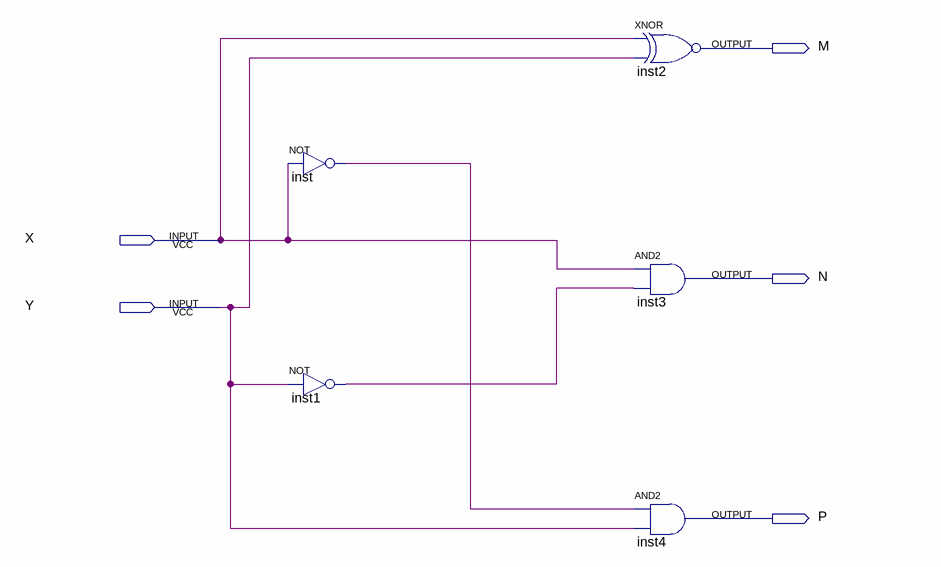
[diagram p0: schematic sheet]
// Quartus schematic DetMagRel1bit.bdf as structural Verilog: 5 symbols, 5 pins
module DetMagRel1bit (
  input  X,
  input  Y,
  output M,
  output N,
  output P
);

  wire inst1_out, inst_out;

  not inst (inst_out, X);
  not inst1 (inst1_out, Y);
  xnor inst2 (M, X, Y);
  and inst3 (N, X, inst1_out);
  and inst4 (P, inst_out, Y);
endmodule
